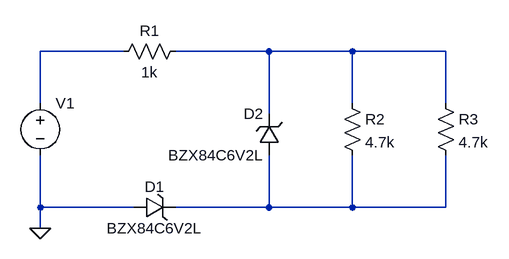
[diagram p0: schematic Experiment 1.asc]
Experiment 1.asc, the LTspice schematic file:
Version 4
SHEET 1 880 680
WIRE 112 64 -16 64
WIRE 336 64 192 64
WIRE 464 64 336 64
WIRE 608 64 464 64
WIRE -16 144 -16 64
WIRE 464 144 464 64
WIRE 608 144 608 64
WIRE 336 160 336 64
WIRE -16 304 -16 224
WIRE 128 304 -16 304
WIRE 336 304 336 224
WIRE 336 304 192 304
WIRE 464 304 464 224
WIRE 464 304 336 304
WIRE 608 304 608 224
WIRE 608 304 464 304
WIRE -16 336 -16 304
FLAG -16 336 0
SYMBOL voltage -16 128 R0
WINDOW 123 0 0 Left 0
WINDOW 39 0 0 Left 0
SYMATTR InstName V1
SYMATTR Value ""
SYMBOL res 208 48 R90
WINDOW 0 0 56 VBottom 2
WINDOW 3 32 56 VTop 2
SYMATTR InstName R1
SYMATTR Value 1k
SYMBOL zener 128 320 R270
WINDOW 0 32 32 VTop 2
WINDOW 3 0 32 VBottom 2
SYMATTR InstName D1
SYMATTR Value BZX84C6V2L
SYMATTR Description Diode
SYMATTR Type diode
SYMBOL zener 352 224 R180
WINDOW 0 24 64 Left 2
WINDOW 3 24 0 Left 2
SYMATTR InstName D2
SYMATTR Value BZX84C6V2L
SYMATTR Description Diode
SYMATTR Type diode
SYMBOL res 448 128 R0
SYMATTR InstName R2
SYMATTR Value 4.7k
SYMBOL res 592 128 R0
SYMATTR InstName R3
SYMATTR Value 4.7k

The netlist it stands for:
* Experiment 1.asc
V1 N001 0
R1 N002 N001 1k
D1 0 N003 BZX84C6V2L
D2 N003 N002 BZX84C6V2L
R2 N002 N003 4.7k
R3 N002 N003 4.7k
.model D D
.lib standard.dio
.backanno
.end